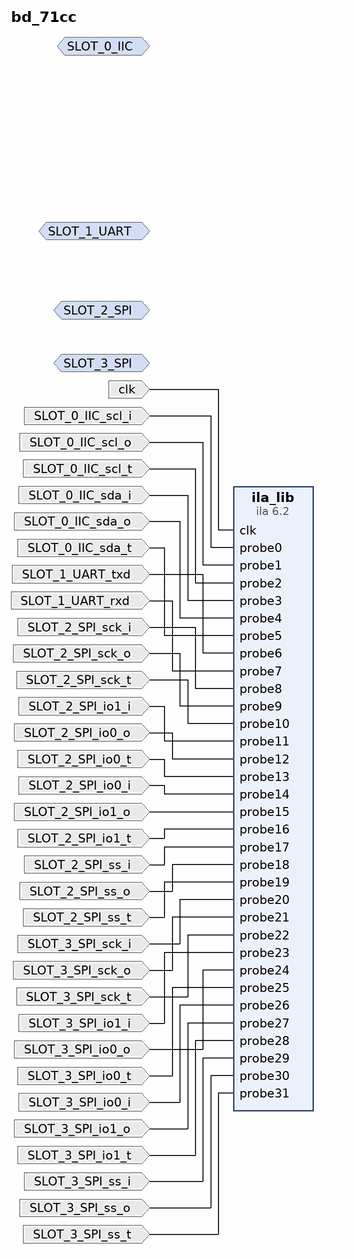
[diagram p0: block diagram of the top level]
# Vivado block design bd_71cc, xczu2cg-sfvc784-1-i, Vivado 2019.2
create_bd_design bd_71cc

create_bd_intf_port -mode Monitor -vlnv xilinx.com:interface:iic_rtl:1.0 SLOT_0_IIC
create_bd_intf_port -mode Monitor -vlnv xilinx.com:interface:uart_rtl:1.0 SLOT_1_UART
create_bd_intf_port -mode Monitor -vlnv xilinx.com:interface:spi_rtl:1.0 SLOT_2_SPI
create_bd_intf_port -mode Monitor -vlnv xilinx.com:interface:spi_rtl:1.0 SLOT_3_SPI
create_bd_port -dir I -type clk clk
create_bd_port -dir I SLOT_0_IIC_scl_i
create_bd_port -dir I SLOT_0_IIC_scl_o
create_bd_port -dir I SLOT_0_IIC_scl_t
create_bd_port -dir I SLOT_0_IIC_sda_i
create_bd_port -dir I SLOT_0_IIC_sda_o
create_bd_port -dir I SLOT_0_IIC_sda_t
create_bd_port -dir I SLOT_1_UART_txd
create_bd_port -dir I SLOT_1_UART_rxd
create_bd_port -dir I SLOT_2_SPI_sck_i
create_bd_port -dir I SLOT_2_SPI_sck_o
create_bd_port -dir I SLOT_2_SPI_sck_t
create_bd_port -dir I SLOT_2_SPI_io1_i
create_bd_port -dir I SLOT_2_SPI_io0_o
create_bd_port -dir I SLOT_2_SPI_io0_t
create_bd_port -dir I SLOT_2_SPI_io0_i
create_bd_port -dir I SLOT_2_SPI_io1_o
create_bd_port -dir I SLOT_2_SPI_io1_t
create_bd_port -dir I SLOT_2_SPI_ss_i
create_bd_port -dir I SLOT_2_SPI_ss_o
create_bd_port -dir I SLOT_2_SPI_ss_t
create_bd_port -dir I SLOT_3_SPI_sck_i
create_bd_port -dir I SLOT_3_SPI_sck_o
create_bd_port -dir I SLOT_3_SPI_sck_t
create_bd_port -dir I SLOT_3_SPI_io1_i
create_bd_port -dir I SLOT_3_SPI_io0_o
create_bd_port -dir I SLOT_3_SPI_io0_t
create_bd_port -dir I SLOT_3_SPI_io0_i
create_bd_port -dir I SLOT_3_SPI_io1_o
create_bd_port -dir I SLOT_3_SPI_io1_t
create_bd_port -dir I SLOT_3_SPI_ss_i
create_bd_port -dir I SLOT_3_SPI_ss_o
create_bd_port -dir I SLOT_3_SPI_ss_t

create_bd_cell -type ip -vlnv xilinx.com:ip:ila:6.2 ila_lib
set_property -dict [list \
  CONFIG.ALL_PROBE_SAME_MU TRUE \
  CONFIG.ALL_PROBE_SAME_MU_CNT 1 \
  CONFIG.C_ADV_TRIGGER FALSE \
  CONFIG.C_DATA_DEPTH 1024 \
  CONFIG.C_EN_STRG_QUAL 0 \
  CONFIG.C_EN_TIME_TAG 0 \
  CONFIG.C_ILA_CLK_FREQ 99999985 \
  CONFIG.C_INPUT_PIPE_STAGES 0 \
  CONFIG.C_MONITOR_TYPE Native \
  CONFIG.C_NUM_OF_PROBES 32 \
  CONFIG.C_PROBE0_TYPE 0 \
  CONFIG.C_PROBE0_WIDTH 1 \
  CONFIG.C_PROBE10_TYPE 0 \
  CONFIG.C_PROBE10_WIDTH 1 \
  CONFIG.C_PROBE11_TYPE 0 \
  CONFIG.C_PROBE11_WIDTH 1 \
  CONFIG.C_PROBE12_TYPE 0 \
  CONFIG.C_PROBE12_WIDTH 1 \
  CONFIG.C_PROBE13_TYPE 0 \
  CONFIG.C_PROBE13_WIDTH 1 \
  CONFIG.C_PROBE14_TYPE 0 \
  CONFIG.C_PROBE14_WIDTH 1 \
  CONFIG.C_PROBE15_TYPE 0 \
  CONFIG.C_PROBE15_WIDTH 1 \
  CONFIG.C_PROBE16_TYPE 0 \
  CONFIG.C_PROBE16_WIDTH 1 \
  CONFIG.C_PROBE17_TYPE 0 \
  CONFIG.C_PROBE17_WIDTH 1 \
  CONFIG.C_PROBE18_TYPE 0 \
  CONFIG.C_PROBE18_WIDTH 1 \
  CONFIG.C_PROBE19_TYPE 0 \
  CONFIG.C_PROBE19_WIDTH 1 \
  CONFIG.C_PROBE1_TYPE 0 \
  CONFIG.C_PROBE1_WIDTH 1 \
  CONFIG.C_PROBE20_TYPE 0 \
  CONFIG.C_PROBE20_WIDTH 1 \
  CONFIG.C_PROBE21_TYPE 0 \
  CONFIG.C_PROBE21_WIDTH 1 \
  CONFIG.C_PROBE22_TYPE 0 \
  CONFIG.C_PROBE22_WIDTH 1 \
  CONFIG.C_PROBE23_TYPE 0 \
  CONFIG.C_PROBE23_WIDTH 1 \
  CONFIG.C_PROBE24_TYPE 0 \
  CONFIG.C_PROBE24_WIDTH 1 \
  CONFIG.C_PROBE25_TYPE 0 \
  CONFIG.C_PROBE25_WIDTH 1 \
  CONFIG.C_PROBE26_TYPE 0 \
  CONFIG.C_PROBE26_WIDTH 1 \
  CONFIG.C_PROBE27_TYPE 0 \
  CONFIG.C_PROBE27_WIDTH 1 \
  CONFIG.C_PROBE28_TYPE 0 \
  CONFIG.C_PROBE28_WIDTH 1 \
  CONFIG.C_PROBE29_TYPE 0 \
  CONFIG.C_PROBE29_WIDTH 1 \
  CONFIG.C_PROBE2_TYPE 0 \
  CONFIG.C_PROBE2_WIDTH 1 \
  CONFIG.C_PROBE30_TYPE 0 \
  CONFIG.C_PROBE30_WIDTH 1 \
  CONFIG.C_PROBE31_TYPE 0 \
  CONFIG.C_PROBE31_WIDTH 1 \
  CONFIG.C_PROBE3_TYPE 0 \
  CONFIG.C_PROBE3_WIDTH 1 \
  CONFIG.C_PROBE4_TYPE 0 \
  CONFIG.C_PROBE4_WIDTH 1 \
  CONFIG.C_PROBE5_TYPE 0 \
  CONFIG.C_PROBE5_WIDTH 1 \
  CONFIG.C_PROBE6_TYPE 0 \
  CONFIG.C_PROBE6_WIDTH 1 \
  CONFIG.C_PROBE7_TYPE 0 \
  CONFIG.C_PROBE7_WIDTH 1 \
  CONFIG.C_PROBE8_TYPE 0 \
  CONFIG.C_PROBE8_WIDTH 1 \
  CONFIG.C_PROBE9_TYPE 0 \
  CONFIG.C_PROBE9_WIDTH 1 \
  CONFIG.C_TIME_TAG_WIDTH 32 \
  CONFIG.C_TRIGIN_EN false \
  CONFIG.C_TRIGOUT_EN false \
  CONFIG.C_XLNX_HW_PROBE_INFO DEFAULT \
] [get_bd_cells ila_lib]

# ---- connections ----

connect_bd_net [get_bd_ports clk] [get_bd_pins ila_lib/clk]
connect_bd_net [get_bd_ports SLOT_0_IIC_scl_i] [get_bd_pins ila_lib/probe0]
connect_bd_net [get_bd_ports SLOT_0_IIC_scl_o] [get_bd_pins ila_lib/probe1]
connect_bd_net [get_bd_ports SLOT_0_IIC_scl_t] [get_bd_pins ila_lib/probe2]
connect_bd_net [get_bd_ports SLOT_0_IIC_sda_i] [get_bd_pins ila_lib/probe3]
connect_bd_net [get_bd_ports SLOT_0_IIC_sda_o] [get_bd_pins ila_lib/probe4]
connect_bd_net [get_bd_ports SLOT_0_IIC_sda_t] [get_bd_pins ila_lib/probe5]
connect_bd_net [get_bd_ports SLOT_1_UART_txd] [get_bd_pins ila_lib/probe6]
connect_bd_net [get_bd_ports SLOT_1_UART_rxd] [get_bd_pins ila_lib/probe7]
connect_bd_net [get_bd_ports SLOT_2_SPI_sck_i] [get_bd_pins ila_lib/probe8]
connect_bd_net [get_bd_ports SLOT_2_SPI_sck_o] [get_bd_pins ila_lib/probe9]
connect_bd_net [get_bd_ports SLOT_2_SPI_sck_t] [get_bd_pins ila_lib/probe10]
connect_bd_net [get_bd_ports SLOT_2_SPI_io1_i] [get_bd_pins ila_lib/probe11]
connect_bd_net [get_bd_ports SLOT_2_SPI_io0_o] [get_bd_pins ila_lib/probe12]
connect_bd_net [get_bd_ports SLOT_2_SPI_io0_t] [get_bd_pins ila_lib/probe13]
connect_bd_net [get_bd_ports SLOT_2_SPI_io0_i] [get_bd_pins ila_lib/probe14]
connect_bd_net [get_bd_ports SLOT_2_SPI_io1_o] [get_bd_pins ila_lib/probe15]
connect_bd_net [get_bd_ports SLOT_2_SPI_io1_t] [get_bd_pins ila_lib/probe16]
connect_bd_net [get_bd_ports SLOT_2_SPI_ss_i] [get_bd_pins ila_lib/probe17]
connect_bd_net [get_bd_ports SLOT_2_SPI_ss_o] [get_bd_pins ila_lib/probe18]
connect_bd_net [get_bd_ports SLOT_2_SPI_ss_t] [get_bd_pins ila_lib/probe19]
connect_bd_net [get_bd_ports SLOT_3_SPI_sck_i] [get_bd_pins ila_lib/probe20]
connect_bd_net [get_bd_ports SLOT_3_SPI_sck_o] [get_bd_pins ila_lib/probe21]
connect_bd_net [get_bd_ports SLOT_3_SPI_sck_t] [get_bd_pins ila_lib/probe22]
connect_bd_net [get_bd_ports SLOT_3_SPI_io1_i] [get_bd_pins ila_lib/probe23]
connect_bd_net [get_bd_ports SLOT_3_SPI_io0_o] [get_bd_pins ila_lib/probe24]
connect_bd_net [get_bd_ports SLOT_3_SPI_io0_t] [get_bd_pins ila_lib/probe25]
connect_bd_net [get_bd_ports SLOT_3_SPI_io0_i] [get_bd_pins ila_lib/probe26]
connect_bd_net [get_bd_ports SLOT_3_SPI_io1_o] [get_bd_pins ila_lib/probe27]
connect_bd_net [get_bd_ports SLOT_3_SPI_io1_t] [get_bd_pins ila_lib/probe28]
connect_bd_net [get_bd_ports SLOT_3_SPI_ss_i] [get_bd_pins ila_lib/probe29]
connect_bd_net [get_bd_ports SLOT_3_SPI_ss_o] [get_bd_pins ila_lib/probe30]
connect_bd_net [get_bd_ports SLOT_3_SPI_ss_t] [get_bd_pins ila_lib/probe31]

validate_bd_design
save_bd_design
